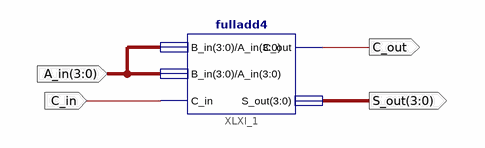
[diagram p0: schematic sheet 1]
// Xilinx ISE schematic Double.sch (spartan6) as structural Verilog: 1 symbols, 4 ports
module Double (
  input  [3:0] A_in,
  input  C_in,
  output C_out,
  output [3:0] S_out
);

  fulladd4 XLXI_1 (.B_in(A_in), .A_in(A_in), .C_in(C_in), .C_out(C_out), .S_out(S_out));
endmodule
